# Altium schematic sheet 1_P1.schdoc.schdoc
size 309 x 223 mm; Symbol: Sheet-Symbol_A4; Device: Sheet-Symbol_A4; Company: 嘉立创EDA; Version: V1.0; Page Size: A4; @Project Name: Idect; @Page Count: 1; @Update Date: 2024-07-18; @Create Date: 2024-07-18; @Schematic Name: Schematic2; @Page No: 1; @Page Name: P1
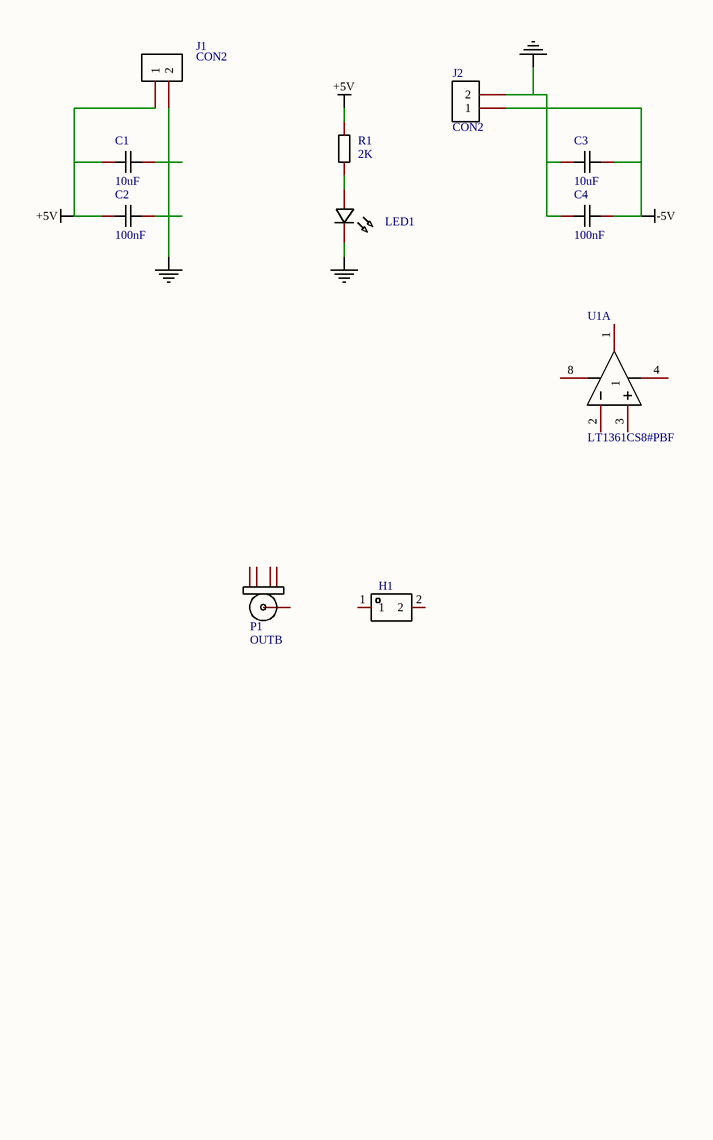
[diagram p0: 1_P1.schdoc.schdoc]

## Parts
C1  10uF  [C0805]
C2  100nF  [C0805]
C3  10uF  [C0805]
C4  100nF  [C0805]
H1  HDR-M_2.54_2x1  [HDR-TH_2P-P2.54-V-M-2]  (value not drawn)
J1  CON2  [sip2e]
J2  CON2  [sip2e]
LED1  LED_0805-R  [LED_0805]  (value not drawn)
P1  OUTB  [SMA-E]
R1  2K  [R0805]
U1  LT1361CS8#PBF  [SO-8_L4.9-W3.9-P1.27-LS5.9-BL]  (part A of 2)

## Nets
+5V: C1.1 C2.1 J1.1 R1.1
-5V: C3.2 C4.2 J2.1
GND: C1.2 C2.2 C3.1 C4.1 J1.2 J2.2 LED1.1(C)
NetLED1_2: LED1.2(A) R1.2

Not connected (* = marked no-connect by the designer): H1 1 2; P1 1(X) 2(GND) 3(GND) 4(GND) 5(GND); U1 1(OUTA) 2(INA-) 3(INA+) 4(V-) 8(V+)

## Notes on the sheet
- 1
- 2
- 3
- 4
- 5
- 6
- A
- B
- C
- 原理图
- Schematic2
- 创建日期
- 更新日期
- 2024-07-18
- 审阅
- 绘制
- 图页
- P1
- 物料编码
- Idect
- D
- 版本
- 尺寸
- 页
- 共
- V1.0
- A4
- 嘉立创EDA

## Library data of the parts
C1-C4 = CAP_0805: Symbol: CapAcitance; Convert to PCB: yes; Device: CAP_0805; Add into BOM: yes; Supplier Footprint: 0805
  C1 C3: Name: 10uF; Value: 10uF
  C2 C4: Name: 100nF; Value: 100nF
H1 = HDR-M_2.54_2x1: Symbol: HDR-M-2.54_2x1; Convert to PCB: yes; Device: HDR-M_2.54_2x1; Add into BOM: yes; Supplier Part: C2883961; Supplier Footprint: 插件,P=2.54mm
J1 J2 = CON2: Add into BOM: yes; Origin Footprint 2: SIP2P; Origin Footprint 3: HT3.96-2; Origin Footprint 4: SIP2; Origin Footprint 5: XH-2A; Name: CON2; Symbol: CON2; Device: CON2; Convert to PCB: yes
LED1 = LED_0805-R: Symbol: LED_R; Convert to PCB: yes; Device: LED_0805-R; Add into BOM: yes; Supplier Footprint: 0805
P1 = BNC: Add into BOM: yes; Name: OUTB; Symbol: BNC; Device: BNC; Convert to PCB: yes; Origin Footprint 2: BNC
R1 = Res_0805: Symbol: 电阻; Convert to PCB: yes; Name: 2K; Device: Res_0805; Add into BOM: yes; Supplier Footprint: 0805; Value: 2K
U1 = LT1361CS8#PBF: Manufacturer: ADI(亚德诺); Add into BOM: yes; Number of Circuits: 双路; Gain Bandwidth Product(GBP): 50MHz; Current - Input Bias(Ib): 300nA; Slew Rate(SR): 800V/us; Output Current: 34mA; Description: 放大器数:双路;增益带宽积(GBP):50MHz;输入偏置电流(Ib):300nA;压摆率(SR):800V/us;带宽(-3db):-;; Name: LT1361CS8#PBF; Symbol: LT1361CS8#PBF; Device: LT1361CS8#PBF; LCSC Part Name: LT1361CS8#PBF; Supplier Part: C579720; Manufacturer Part: LT1361CS8#PBF; Supplier Footprint: SO-8; JLCPCB Part Class: 扩展库; Datasheet: https://atta.szlcsc.com/upload/public/pdf/source/20200824/C579720_E3C843831E8BF30D41BDE101BF52A14A.pdf; Supplier: LCSC; Convert to PCB: yes; -3db Bandwidth: -; Operating Temperature: -40℃~+85℃